# EAGLE design DSP_MOTU1_proto (EAGLE 7.3.0)

## Sheet 1 of 3: CON
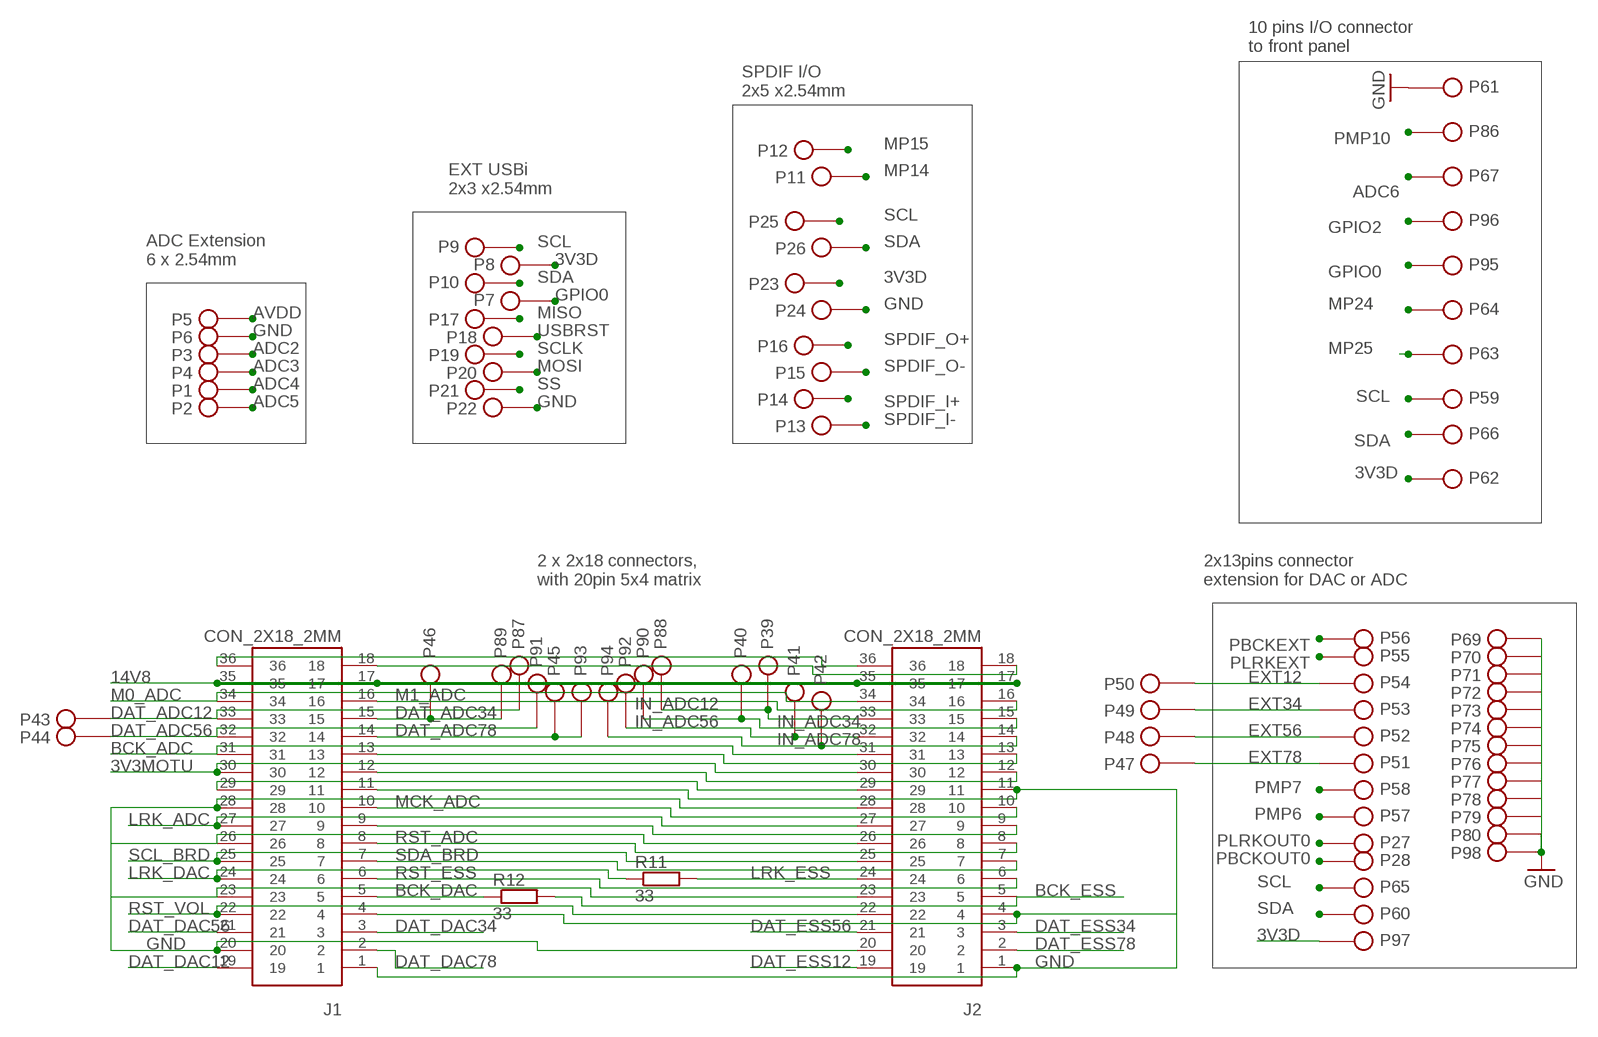
[diagram p0: schematic, sheet 1]

### Parts
J1  CON_2X18_2MM  [CON_2X18_2MM]
J2  CON_2X18_2MM  [CON_2X18_2MM]
P1  PIN_254  [PIN_254]
P2  PIN_254  [PIN_254]
P3  PIN_254  [PIN_254]
P4  PIN_254  [PIN_254]
P5  PIN_254  [PIN_254]
P6  PIN_254  [PIN_254]
P7  PIN_254  [PIN_254]
P8  PIN_254  [PIN_254]
P9  PIN_254  [PIN_254]
P10  PIN_254  [PIN_254]
P11  PIN_254  [PIN_254]
P12  PIN_254  [PIN_254]
P13  PIN_254  [PIN_254]
P14  PIN_254  [PIN_254]
P15  PIN_254  [PIN_254]
P16  PIN_254  [PIN_254]
P17  PIN_254  [PIN_254]
P18  PIN_254  [PIN_254]
P19  PIN_254  [PIN_254]
P20  PIN_254  [PIN_254]
P21  PIN_254  [PIN_254]
P22  PIN_254  [PIN_254]
P23  PIN_254  [PIN_254]
P24  PIN_254  [PIN_254]
P25  PIN_254  [PIN_254]
P26  PIN_254  [PIN_254]
P27  PIN_254  [PIN_254]
P28  PIN_254  [PIN_254]
P39  PIN_254  [PIN_254]
P40  PIN_254  [PIN_254]
P41  PIN_254  [PIN_254]
P42  PIN_254  [PIN_254]
P43  PIN_254  [PIN_254]
P44  PIN_254  [PIN_254]
P45  PIN_254  [PIN_254]
P46  PIN_254  [PIN_254]
P47  PIN_254  [PIN_254]
P48  PIN_254  [PIN_254]
P49  PIN_254  [PIN_254]
P50  PIN_254  [PIN_254]
P51  PIN_254  [PIN_254]
P52  PIN_254  [PIN_254]
P53  PIN_254  [PIN_254]
P54  PIN_254  [PIN_254]
P55  PIN_254  [PIN_254]
P56  PIN_254  [PIN_254]
P57  PIN_254  [PIN_254]
P58  PIN_254  [PIN_254]
P59  PIN_254  [PIN_254]
P60  PIN_254  [PIN_254]
P61  PIN_254  [PIN_254]
P62  PIN_254  [PIN_254]
P63  PIN_254  [PIN_254]
P64  PIN_254  [PIN_254]
P65  PIN_254  [PIN_254]
P66  PIN_254  [PIN_254]
P67  PIN_254  [PIN_254]
P69  PIN_254  [PIN_254]
P70  PIN_254  [PIN_254]
P71  PIN_254  [PIN_254]
P72  PIN_254  [PIN_254]
P73  PIN_254  [PIN_254]
P74  PIN_254  [PIN_254]
P75  PIN_254  [PIN_254]
P76  PIN_254  [PIN_254]
P77  PIN_254  [PIN_254]
P78  PIN_254  [PIN_254]
P79  PIN_254  [PIN_254]
P80  PIN_254  [PIN_254]
P86  PIN_254  [PIN_254]
P87  PIN_254  [PIN_254]
P88  PIN_254  [PIN_254]
P89  PIN_254  [PIN_254]
P90  PIN_254  [PIN_254]
P91  PIN_254  [PIN_254]
P92  PIN_254  [PIN_254]
P93  PIN_254  [PIN_254]
P94  PIN_254  [PIN_254]
P95  PIN_254  [PIN_254]
P96  PIN_254  [PIN_254]
P97  PIN_254  [PIN_254]
P98  PIN_254  [PIN_254]
R11  33  R-EU_R0805  [R0805]
R12  33  R-EU_R0805  [R0805]

### Nets
3V3D: P8.1 P23.1 P62.1 P97.1 ; also sheet 2,3
3V3MOTU: J1.30 J2.30
14V8: J1.17 J1.35 J2.17 J2.35 ; also sheet 3
ADC2: P3.1 ; also sheet 2
ADC3: P4.1 ; also sheet 2
ADC4: P1.1 ; also sheet 2
ADC5: P2.1 ; also sheet 2
ADC6: P67.1 ; also sheet 2
AVDD: P5.1 ; also sheet 2
BCK_ADC: J1.31 J2.31 ; also sheet 2
BCK_DAC: J1.5 R12.1 ; also sheet 2
BCK_ESS: J2.5 R12.2 ; also sheet 2
DAT_ADC12: J1.33 P43.1 P87.1
DAT_ADC34: J1.15 P46.1 P89.1
DAT_ADC56: J1.32 P44.1 P91.1
DAT_ADC78: J1.14 P45.1 P93.1
DAT_DAC12: J1.19 ; also sheet 2
DAT_DAC34: J1.3 ; also sheet 2
DAT_DAC56: J1.21 ; also sheet 2
DAT_DAC78: J1.2 ; also sheet 2
DAT_ESS12: J2.19 ; also sheet 2
DAT_ESS34: J2.3 ; also sheet 2
DAT_ESS56: J2.21 ; also sheet 2
DAT_ESS78: J2.2 ; also sheet 2
EXT12: P50.1 P54.1
EXT34: P49.1 P53.1
EXT56: P48.1 P52.1
EXT78: P47.1 P51.1
GND: J1.1 J1.4 J1.11 J1.20 J1.23 J1.26 J1.28 J2.1 J2.4 J2.11 J2.20 J2.23 J2.26 J2.28 P6.1 P22.1 P24.1 P61.1 P69.1 P70.1 P71.1 P72.1 P73.1 P74.1 P75.1 P76.1 P77.1 P78.1 P79.1 P80.1 P98.1 ; also sheet 2,3
GPIO0: P7.1 P95.1 ; also sheet 3
GPIO2: P96.1 ; also sheet 3
IN_ADC12: J2.33 P39.1 P88.1
IN_ADC34: J2.15 P40.1 P90.1
IN_ADC56: J2.32 P41.1 P92.1
IN_ADC78: J2.14 P42.1 P94.1
LRK_ADC: J1.27 J2.27 ; also sheet 2
LRK_DAC: J1.24 R11.1 ; also sheet 2
LRK_ESS: J2.24 R11.2 ; also sheet 2
M0_ADC: J1.34 J2.34
M1_ADC: J1.16 J2.16
MCK_ADC: J1.10 J2.10
MISO: P17.1 ; also sheet 2,3
MOSI: P20.1 ; also sheet 2,3
MP14: P11.1 ; also sheet 2
MP15: P12.1 ; also sheet 2
MP24: P64.1 ; also sheet 2
MP25: P63.1 ; also sheet 2
N$51: J1.9 J2.9
N$54: J1.29 J2.29
N$55: J1.12 J2.12
N$56: J1.13 J2.13
N$57: J1.18 J2.18
N$58: J1.36 J2.36
PBCKEXT: P56.1 ; also sheet 2
PBCKOUT0: P28.1 ; also sheet 2
PLRKEXT: P55.1 ; also sheet 2
PLRKOUT0: P27.1 ; also sheet 2
PMP6: P57.1 ; also sheet 2
PMP7: P58.1 ; also sheet 2
PMP10: P86.1 ; also sheet 2,3
RST_ADC: J1.8 J2.8
RST_ESS: J1.6 J2.6
RST_VOL: J1.22 J2.22 ; also sheet 2
SCL: P9.1 P25.1 P59.1 P65.1 ; also sheet 3
SCL_BRD: J1.25 J2.25
SCLK: P19.1 ; also sheet 2,3
SDA: P10.1 P26.1 P60.1 P66.1 ; also sheet 3
SDA_BRD: J1.7 J2.7
SPDIF_I+: P14.1 ; also sheet 2
SPDIF_I-: P13.1 ; also sheet 2
SPDIF_O+: P16.1 ; also sheet 2
SPDIF_O-: P15.1 ; also sheet 2
SS: P21.1 ; also sheet 2,3
USBRST: P18.1 ; also sheet 2

### Notes on the sheet
- 10 pins I/O connector
  to front panel
- SPDIF I/O
  2x5 x2.54mm
- EXT USBi
  2x3 x2.54mm
- ADC Extension
  6 x 2.54mm
- 2 x 2x18 connectors, 
  with 20pin 5x4 matrix
- 2x13pins connector
  extension for DAC or ADC

## Sheet 2 of 3: DSP
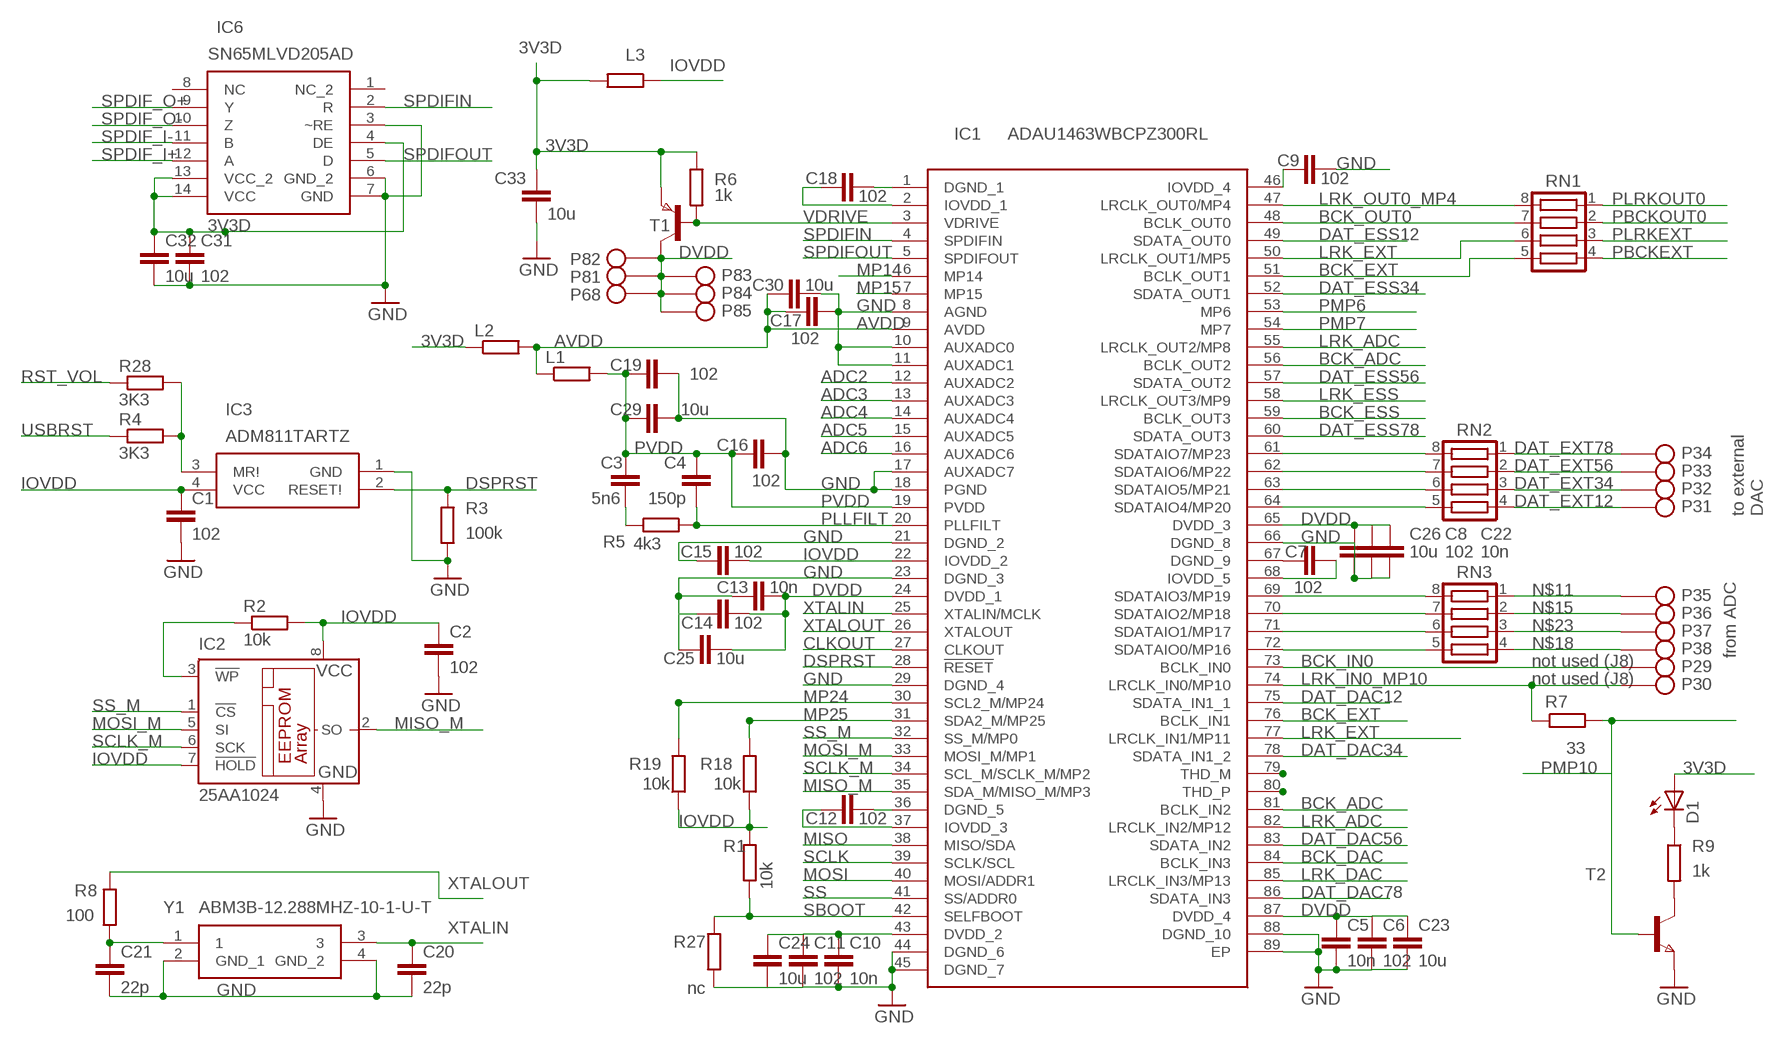
[diagram p1: schematic, sheet 2]

### Parts
C1  102  C-EUC0603  [C0603]
C2  102  C-EUC0603  [C0603]
C3  5n6  C-EUC0402  [C0402]
C4  150p  C-EUC0402  [C0402]
C5  10n  C-EUC0402  [C0402]
C6  102  C-EUC0402  [C0402]
C7  102  C-EUC0402  [C0402]
C8  102  C-EUC0402  [C0402]
C9  102  C-EUC0402  [C0402]
C10  10n  C-EUC0402  [C0402]
C11  102  C-EUC0402  [C0402]
C12  102  C-EUC0402  [C0402]
C13  10n  C-EUC0402  [C0402]
C14  102  C-EUC0402  [C0402]
C15  102  C-EUC0402  [C0402]
C16  102  C-EUC0402  [C0402]
C17  102  C-EUC0402  [C0402]
C18  102  C-EUC0402  [C0402]
C19  102  C-EUC0603  [C0603]
C20  22p  C-EUC0402  [C0402]
C21  22p  C-EUC0402  [C0402]
C22  10n  C-EUC0402  [C0402]
C23  10u  C-EUC0805  [C0805]
C24  10u  C-EUC0805  [C0805]
C25  10u  C-EUC0805  [C0805]
C26  10u  C-EUC0805  [C0805]
C29  10u  C-EUC0805  [C0805]
C30  10u  C-EUC0805  [C0805]
C31  102  C-EUC0603  [C0603]
C32  10u  C-EUC0805  [C0805]
C33  10u  C-EUC0805  [C0805]
D1  LEDCHIPLED_0805  [CHIPLED_0805]
IC1  ADAU1463WBCPZ300RL  [ADAU1463WBCPZ300RL]
IC2  25AA1024  25AA080SN  [SO-08]
IC3  ADM811TARTZ  ADM811RARTZ-REEL7  [SOT192P237X117-4N]
IC6  SN65MLVD205AD  [SOIC127P600X175-14N]
L1  R-EU_R0603  [R0603]
L2  R-EU_R0603  [R0603]
L3  R-EU_R0805  [R0805]
P29  PIN_254  [PIN_254]
P30  PIN_254  [PIN_254]
P31  PIN_254  [PIN_254]
P32  PIN_254  [PIN_254]
P33  PIN_254  [PIN_254]
P34  PIN_254  [PIN_254]
P35  PIN_254  [PIN_254]
P36  PIN_254  [PIN_254]
P37  PIN_254  [PIN_254]
P38  PIN_254  [PIN_254]
P68  PIN_254  [PIN_254]
P81  PIN_254  [PIN_254]
P82  PIN_254  [PIN_254]
P83  PIN_254  [PIN_254]
P84  PIN_254  [PIN_254]
P85  PIN_254  [PIN_254]
R1  10k  R-EU_R0603  [R0603]
R2  10k  R-EU_R0603  [R0603]
R3  100k  R-EU_R0603  [R0603]
R4  3K3  R-EU_R0603  [R0603]
R5  4k3  R-EU_R0402  [R0402]
R6  1k  R-EU_R0603  [R0603]
R7  33  R-EU_R0805  [R0805]
R8  100  R-EU_R0402  [R0402]
R9  1k  R-EU_R0603  [R0603]
R18  10k  R-EU_R0603  [R0603]
R19  10k  R-EU_R0603  [R0603]
R27  nc  R-EU_R0603  [R0603]
R28  3K3  R-EU_R0603  [R0603]
RN1  CTS742C083  [CTS742C083]
RN2  CTS742C083  [CTS742C083]
RN3  CTS742C083  [CTS742C083]
T1  PNPSOT89  [SOT89]
T2  NPNSOT23  [SOT-23]
Y1  ABM3B-12.288MHZ-10-1-U-T  [ABM3B]

### Nets
3V3D: C31.1 C32.1 C33.1 D1.A IC6.4(DE) IC6.13(VCC_2) IC6.14(VCC) L2.1 L3.2 R6.1 T1.3(E) ; also sheet 1,3
ADC2: IC1.12(AUXADC2) ; also sheet 1
ADC3: IC1.13(AUXADC3) ; also sheet 1
ADC4: IC1.14(AUXADC4) ; also sheet 1
ADC5: IC1.15(AUXADC5) ; also sheet 1
ADC6: IC1.16(AUXADC6) ; also sheet 1
AVDD: C17.1 C30.1 IC1.9(AVDD) L1.1 L2.2 ; also sheet 1
BCK_ADC: IC1.56(BCLK_OUT2) IC1.81(BCLK_IN2) ; also sheet 1
BCK_DAC: IC1.84(BCLK_IN3) ; also sheet 1
BCK_ESS: IC1.59(BCLK_OUT3) ; also sheet 1
BCK_EXT: IC1.51(BCLK_OUT1) IC1.76(BCLK_IN1) RN1.5
BCK_IN0: IC1.73(BCLK_IN0) P29.1
BCK_OUT0: IC1.48(BCLK_OUT0) RN1.7
CLKOUT: IC1.27(CLKOUT)
DAT_DAC12: IC1.75(SDATA_IN1_1) ; also sheet 1
DAT_DAC34: IC1.78(SDATA_IN1_2) ; also sheet 1
DAT_DAC56: IC1.83(SDATA_IN2) ; also sheet 1
DAT_DAC78: IC1.86(SDATA_IN3) ; also sheet 1
DAT_ESS12: IC1.49(SDATA_OUT0) ; also sheet 1
DAT_ESS34: IC1.52(SDATA_OUT1) ; also sheet 1
DAT_ESS56: IC1.57(SDATA_OUT2) ; also sheet 1
DAT_ESS78: IC1.60(SDATA_OUT3) ; also sheet 1
DAT_EXT12: P31.1 RN2.4
DAT_EXT34: P32.1 RN2.3
DAT_EXT56: P33.1 RN2.2
DAT_EXT78: P34.1 RN2.1
DAT_IO12: IC1.72(SDATAIO0/MP16) RN3.5
DSPRST: IC1.28(!RESET) IC3.2(RESET!) R3.1 ; also sheet 3
DVDD: C5.1 C6.1 C8.1 C10.1 C11.1 C13.1 C14.1 C22.1 C23.1 C24.1 C25.1 C26.2 IC1.24(DVDD_1) IC1.43(DVDD_2) IC1.65(DVDD_3) IC1.87(DVDD_4) P68.1 P81.1 P82.1 P83.1 P84.1 P85.1 T1.2(C) T1.2@1(C)
GND: C1.2 C2.2 C5.2 C6.2 C7.2 C8.2 C9.2 C10.2 C11.2 C12.2 C13.2 C14.2 C15.2 C16.2 C17.2 C18.2 C19.2 C20.2 C21.2 C22.2 C23.2 C24.2 C25.2 C26.1 C29.2 C30.2 C31.2 C32.2 C33.2 IC1.1(DGND_1) IC1.8(AGND) IC1.10(AUXADC0) IC1.11(AUXADC1) IC1.17(AUXADC7) IC1.18(PGND) IC1.21(DGND_2) IC1.23(DGND_3) IC1.29(DGND_4) IC1.36(DGND_5) IC1.44(DGND_6) IC1.45(DGND_7) IC1.66(DGND_8) IC1.67(DGND_9) IC1.88(DGND_10) IC1.89(EP) IC2.4(GND) IC3.1(GND) IC6.3(~RE) IC6.6(GND_2) IC6.7(GND) R3.2 R27.1 T2.2(E) Y1.2(GND_1) Y1.4(GND_2) ; also sheet 1,3
IOVDD: C1.1 C2.1 C7.1 C9.1 C12.1 C15.1 C18.1 IC1.2(IOVDD_1) IC1.22(IOVDD_2) IC1.37(IOVDD_3) IC1.46(IOVDD_4) IC1.68(IOVDD_5) IC2.7(!HOLD) IC2.8(VCC) IC3.4(VCC) L3.1 R1.2 R2.2 R18.1 R19.1
LRK_ADC: IC1.55(LRCLK_OUT2/MP8) IC1.82(LRCLK_IN2/MP12) ; also sheet 1
LRK_DAC: IC1.85(LRCLK_IN3/MP13) ; also sheet 1
LRK_ESS: IC1.58(LRCLK_OUT3/MP9) ; also sheet 1
LRK_EXT: IC1.50(LRCLK_OUT1/MP5) IC1.77(LRCLK_IN1/MP11) RN1.6
LRK_IN0_MP10: IC1.74(LRCLK_IN0/MP10) P30.1 R7.1
LRK_OUT0_MP4: IC1.47(LRCLK_OUT0/MP4) RN1.8
MISO: IC1.38(MISO/SDA) ; also sheet 1,3
MISO_M: IC1.35(SDA_M/MISO_M/MP3) IC2.2(SO)
MOSI: IC1.40(MOSI/ADDR1) ; also sheet 1,3
MOSI_M: IC1.33(MOSI_M/MP1) IC2.5(SI)
MP14: IC1.6(MP14) ; also sheet 1
MP15: IC1.7(MP15) ; also sheet 1
MP24: IC1.30(SCL2_M/MP24) R19.2 ; also sheet 1
MP25: IC1.31(SDA2_M/MP25) R18.2 ; also sheet 1
N$1: R9.2 T2.1(C)
N$2: IC1.64(SDATAIO4/MP20) RN2.5
N$3: IC1.63(SDATAIO5/MP21) RN2.6
N$4: IC2.3(!WP) R2.1
N$5: IC1.62(SDATAIO6/MP22) RN2.7
N$6: IC1.61(SDATAIO7/MP23) RN2.8
N$7: IC1.70(SDATAIO2/MP18) RN3.7
N$8: IC1.71(SDATAIO1/MP17) RN3.6
N$9: IC1.79(THD_M)
N$10: C21.1 R8.1 Y1.1
N$11: P35.1 RN3.1
N$12: C3.2 R5.2
N$13: IC1.69(SDATAIO3/MP19) RN3.8
N$14: D1.C R9.1
N$15: P36.1 RN3.2
N$17: IC1.80(THD_P)
N$18: P38.1 RN3.4
N$23: P37.1 RN3.3
PBCKEXT: RN1.4 ; also sheet 1
PBCKOUT0: RN1.2 ; also sheet 1
PLLFILT: C4.2 IC1.20(PLLFILT) R5.1
PLRKEXT: RN1.3 ; also sheet 1
PLRKOUT0: RN1.1 ; also sheet 1
PMP6: IC1.53(MP6) ; also sheet 1
PMP7: IC1.54(MP7) ; also sheet 1
PMP10: R7.2 T2.3(B) ; also sheet 1,3
PVDD: C3.1 C4.1 C16.1 C19.1 C29.1 IC1.19(PVDD) L1.2
RST_VOL: R28.1 ; also sheet 1
SBOOT: IC1.42(SELFBOOT) R1.1 R27.2
SCLK: IC1.39(SCLK/SCL) ; also sheet 1,3
SCLK_M: IC1.34(SCL_M/SCLK_M/MP2) IC2.6(SCK)
SPDIF_I+: IC6.12(A) ; also sheet 1
SPDIF_I-: IC6.11(B) ; also sheet 1
SPDIF_O+: IC6.9(Y) ; also sheet 1
SPDIF_O-: IC6.10(Z) ; also sheet 1
SPDIFIN: IC1.4(SPDIFIN) IC6.2(R)
SPDIFOUT: IC1.5(SPDIFOUT) IC6.5(D)
SS: IC1.41(SS/ADDR0) ; also sheet 1,3
SS_M: IC1.32(SS_M/MP0) IC2.1(!CS)
USBRST: R4.1 ; also sheet 1
USBRST_: IC3.3(MR!) R4.2 R28.2
VDRIVE: IC1.3(VDRIVE) R6.2 T1.1(B)
XTALIN: C20.1 IC1.25(XTALIN/MCLK) Y1.3
XTALOUT: IC1.26(XTALOUT) R8.2
Unconnected: IC6.1(NC_2) IC6.8(NC)

### Notes on the sheet
- to external
  DAC
- from ADC
- not used (J8)
- not used (J8)

## Sheet 3 of 3: IO-ESP
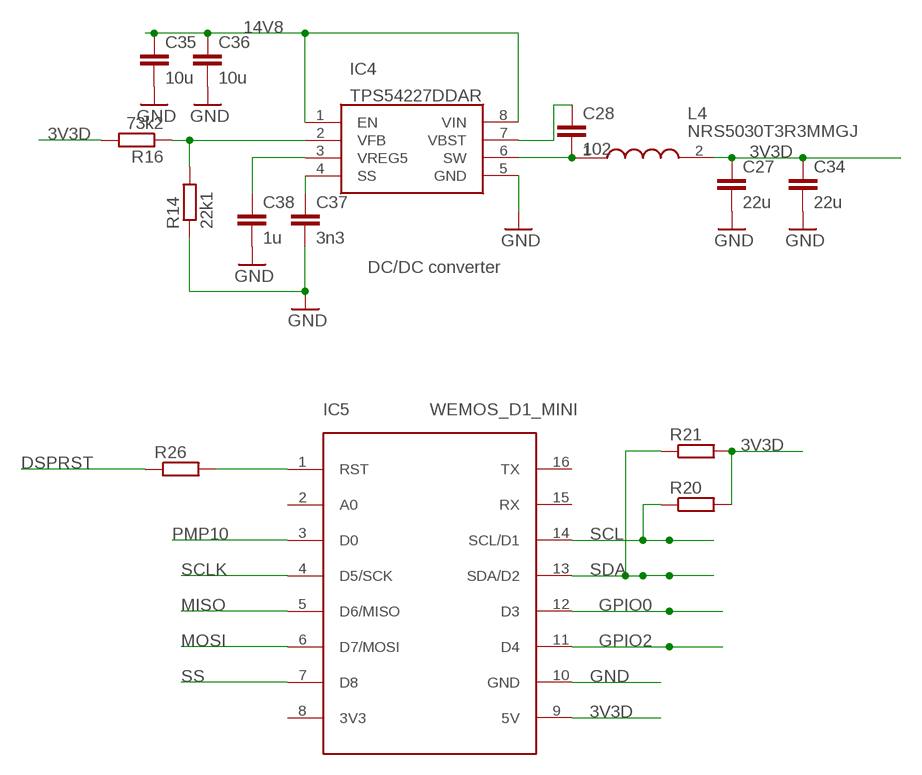
[diagram p2: schematic, sheet 3]

### Parts
C27  22u  C-EUC1206  [C1206]
C28  102  C-EUC0603  [C0603]
C34  22u  C-EUC1206  [C1206]
C35  10u  C-EUC1210  [C1210]
C36  10u  C-EUC1210  [C1210]
C37  3n3  C-EUC0603  [C0603]
C38  1u  C-EUC0603K  [C0603K]
IC4  TPS54227DDAR  [SOIC127P600X170-8N]
IC5  WEMOS_D1_MINI  [WEMOS_D1_MINI]
L4  NRS5030T3R3MMGJ  [INDC4949X330N]
R14  22k1  R-EU_R0603  [R0603]
R16  73k2  R-EU_R0603  [R0603]
R20  R-EU_R0603  [R0603]
R21  R-EU_R0603  [R0603]
R26  R-EU_R0603  [R0603]

### Nets
3V3D: C27.1 C34.1 IC5.9(5V) L4.2 R16.2 R20.2 R21.2 ; also sheet 1,2
14V8: C35.1 C36.1 IC4.1(EN) IC4.8(VIN) ; also sheet 1
D1_RST: IC5.1(RST) R26.2
DSPRST: R26.1 ; also sheet 2
GND: C27.2 C34.2 C35.2 C36.2 C37.2 C38.2 IC4.5(GND) IC5.10(GND) R14.1 ; also sheet 1,2
GPIO0: IC5.12(D3) ; also sheet 1
GPIO2: IC5.11(D4) ; also sheet 1
MISO: IC5.5(D6/MISO) ; also sheet 1,2
MOSI: IC5.6(D7/MOSI) ; also sheet 1,2
N$19: C28.2 IC4.6(SW) L4.1
N$20: C28.1 IC4.7(VBST)
N$22: C37.1 IC4.4(SS)
N$32: C38.1 IC4.3(VREG5)
N$33: IC4.2(VFB) R14.2 R16.1
PMP10: IC5.3(D0) ; also sheet 1,2
SCL: IC5.14(SCL/D1) R20.1 ; also sheet 1
SCLK: IC5.4(D5/SCK) ; also sheet 1,2
SDA: IC5.13(SDA/D2) R21.1 ; also sheet 1
SS: IC5.7(D8) ; also sheet 1,2
Unconnected: IC5.2(A0) IC5.8(3V3) IC5.15(RX) IC5.16(TX)

### Notes on the sheet
- DC/DC converter

## Library data of the parts
C1-C38 = rcl:C-EU: CAPACITOR, European symbol
D1 = led:LED: LED OSRAM: - CHIPLED LG R971, LG N971, LY N971, LG Q971, LY Q971, LO R971, LY R971 LH N974, LH R974 LS Q976, LO Q976, LY Q976 LO Q996 - Hyper CHIPLED LW Q18S LB Q993, LB Q99A, LB R99A - SideLED LS A670, LO A670, LY A670, LG A670, LP A670 LB A673, LV A673, LT A673, LW A673 LH A674 LY A675 LS A676, LA A676, LO A676, LY A676, LW A676 LS A679, LY A679, LG A679 - Hyper Micro SIDELED® LS Y876, LA Y876, LO Y876, LY Y876 LT Y87S - SmartLED LW L88C, LW L88S LB L89C, LB L89S, LG L890 LS L89K, LO L89K, LY L89K LS L896, LA L896, LO L896, LY L896 - TOPLED LS T670, LO T670, LY T670, LG T670, LP T670 LSG T670, LSP T670, LSY T670, LOP T670, LYG T670 LG T671, LOG T671, LSG T671 LB T673, LV T673, LT T673, LW T673 LH T674 LS T676, LA T676, LO T676, LY T676, LB T676, LH T676, LSB T676, LW T676 LB T67C, LV T67C, LT T67C, LS T67K, LO T67K, LY T67K, LW E67C LS E67B, LA E67B, LO E67B, LY E67B, LB E67C, LV E67C, LT E67C LW T67C LS T679, LY T679, LG T679 LS T770, LO T770, LY T770, LG T770, LP T770 LB T773, LV T773, LT T773, LW T773 LH T774 LS E675, LA E675, LY E675, LS T675 LS T776, LA T776, LO T776, LY T776, LB T776 LHGB T686 LT T68C, LB T68C - Hyper Mini TOPLED® LB M676 - Mini TOPLED Santana® LG M470 LS M47K, LO M47K, LY M47K Source: http://www.osram.convergy.de LUXEON: - LUMILED® LXK2-PW12-R00, LXK2-PW12-S00, LXK2-PW14-U00, LXK2-PW14-V00 LXK2-PM12-R00, LXK2-PM12-S00, LXK2-PM14-U00 LXK2-PE12-Q00, LXK2-PE12-R00, LXK2-PE12-S00, LXK2-PE14-T00, LXK2-PE14-U00 LXK2-PB12-K00, LXK2-PB12-L00, LXK2-PB12-M00, LXK2-PB14-N00, LXK2-PB14-P00, LXK2-PB14-Q00 LXK2-PR12-L00, LXK2-PR12-M00, LXK2-PR14-Q00, LXK2-PR14-R00 LXK2-PD12-Q00, LXK2-PD12-R00, LXK2-PD12-S00 LXK2-PH12-R00, LXK2-PH12-S00 LXK2-PL12-P00, LXK2-PL12-Q00, LXK2-PL12-R00 Source: www.luxeon.com KINGBRIGHT: KA-3528ASYC Source: www.kingbright.com
IC1 = SamacSys_Parts:ADAU1463WBCPZ300RL: Audio DSPs 32bit SigmaDSP Audio 16K/48K Source: Datasheet <https://mentor.componentsearchengine.com/Datasheets/1/ADAU1463WBCPZ300RL.pdf>; DESCRIPTION: Audio DSPs 32bit SigmaDSP Audio 16K/48K; HEIGHT: 0mm; MANUFACTURER_NAME: Analog Devices; MANUFACTURER_PART_NUMBER: ADAU1463WBCPZ300RL; MOUSER_PART_NUMBER: 584-AU1463WBCPZ300RL; MOUSER_PRICE-STOCK: https://www.mouser.com/Search/Refine.aspx?Keyword=584-AU1463WBCPZ300RL
IC2 = microchip:25*: Serial EEPROM 4K/ 8K , SPI bus; MF: MICROCHIP; MPN: 25AA080/SN; OC_FARNELL: 1816072; OC_NEWARK: 92C7351
IC3 = SamacSys_Parts:ADM811RARTZ-REEL7: Analog Devices ADM811RARTZ-REEL7, Processor Supervisor 2.5 5 V, Reset Input, 4-Pin SOT-143 Source: Datasheet <https://componentsearchengine.com/Datasheets/1/ADM811RARTZ-REEL7.pdf>; DESCRIPTION: Analog Devices ADM811RARTZ-REEL7, Processor Supervisor 2.5 5 V, Reset Input, 4-Pin SOT-143; HEIGHT: mm; MANUFACTURER_NAME: Analog Devices; MANUFACTURER_PART_NUMBER: ADM811RARTZ-REEL7; MOUSER_PART_NUMBER: 584-ADM811RARTZ-R7
IC4 = SamacSys_Parts:TPS54227DDAR: 4.5V to 18V Input, 2A Synchronous Step-Down Converter Source: Datasheet <http://www.ti.com/lit/gpn/tps54227>; DESCRIPTION: 4.5V to 18V Input, 2A Synchronous Step-Down Converter; HEIGHT: 1.7mm; MANUFACTURER_NAME: Texas Instruments; MANUFACTURER_PART_NUMBER: TPS54227DDAR; MOUSER_PART_NUMBER: 595-TPS54227DDAR
IC5 = perso:WEMOS_D1_MINI
IC6 = SamacSys_Parts:SN65MLVD205AD: MULTIPOINT-LVDS LINE DRIVER AND RECEIVER Source: Datasheet <http://www.ti.com/lit/gpn/sn65mlvd205a>; DESCRIPTION: MULTIPOINT-LVDS LINE DRIVER AND RECEIVER; HEIGHT: mm; MANUFACTURER_NAME: Texas Instruments; MANUFACTURER_PART_NUMBER: SN65MLVD205AD; MOUSER_PART_NUMBER: 595-SN65MLVD205AD
J1 J2 = perso:CON_2X18_2MM
L1-L3 R1-R9 R11 R12 R14 R16 R18-R21 R26-R28 = rcl:R-EU_: RESISTOR, European symbol
L4 = SamacSys_Parts:NRS5030T3R3MMGJ: Fixed Inductors INDCTR LW PROFL WND 3.3uH +/- 20% TOL Source: Datasheet <https://componentsearchengine.com/Datasheets/1/NRS5030T3R3MMGJ.pdf>; DESCRIPTION: Fixed Inductors INDCTR LW PROFL WND 3.3uH +/- 20% TOL; HEIGHT: 3.3mm; MANUFACTURER_NAME: TAIYO YUDEN; MANUFACTURER_PART_NUMBER: NRS5030T3R3MMGJ; MOUSER_PART_NUMBER: 963-NRS5030T3R3MMGJ
P1-P98 = perso:PIN_254
RN1-RN3 = resistor-net:CTS742C083: Chip Resistor Array 4 Single Resistor Source: http://www.ctscorp.com/components/Datasheets/CTSChipArrayDs.pdf; OC_FARNELL: unknown; OC_NEWARK: unknown
T1 = zetex:PNPSOT89: PNP TRANSISTOR; MPN: 2DB1713-13; OC_FARNELL: 1710687; OC_NEWARK: 25R5670
T2 = zetex:NPNSOT23: NPN TRANSISTOR; MPN: DSS20201L-7; OC_FARNELL: 1710688; OC_NEWARK: 25R4555
Y1 = SamacSys_Parts:ABM3B-12.288MHZ-10-1-U-T: ABRACON - ABM3B-12.288MHZ-10-1-U-T - CRYSTAL, 12.288MHZ, 10PF, 5 X 3.2MM Source: Datasheet <https://componentsearchengine.com/Datasheets/1/ABM3B-12.288MHZ-10-1-U-T.pdf>; DESCRIPTION: ABRACON - ABM3B-12.288MHZ-10-1-U-T - CRYSTAL, 12.288MHZ, 10PF, 5 X 3.2MM; HEIGHT: mm; MANUFACTURER_NAME: ABRACON; MANUFACTURER_PART_NUMBER: ABM3B-12.288MHZ-10-1-U-T; MOUSER_PART_NUMBER: 815-ABM3B-12.288-T

## Board
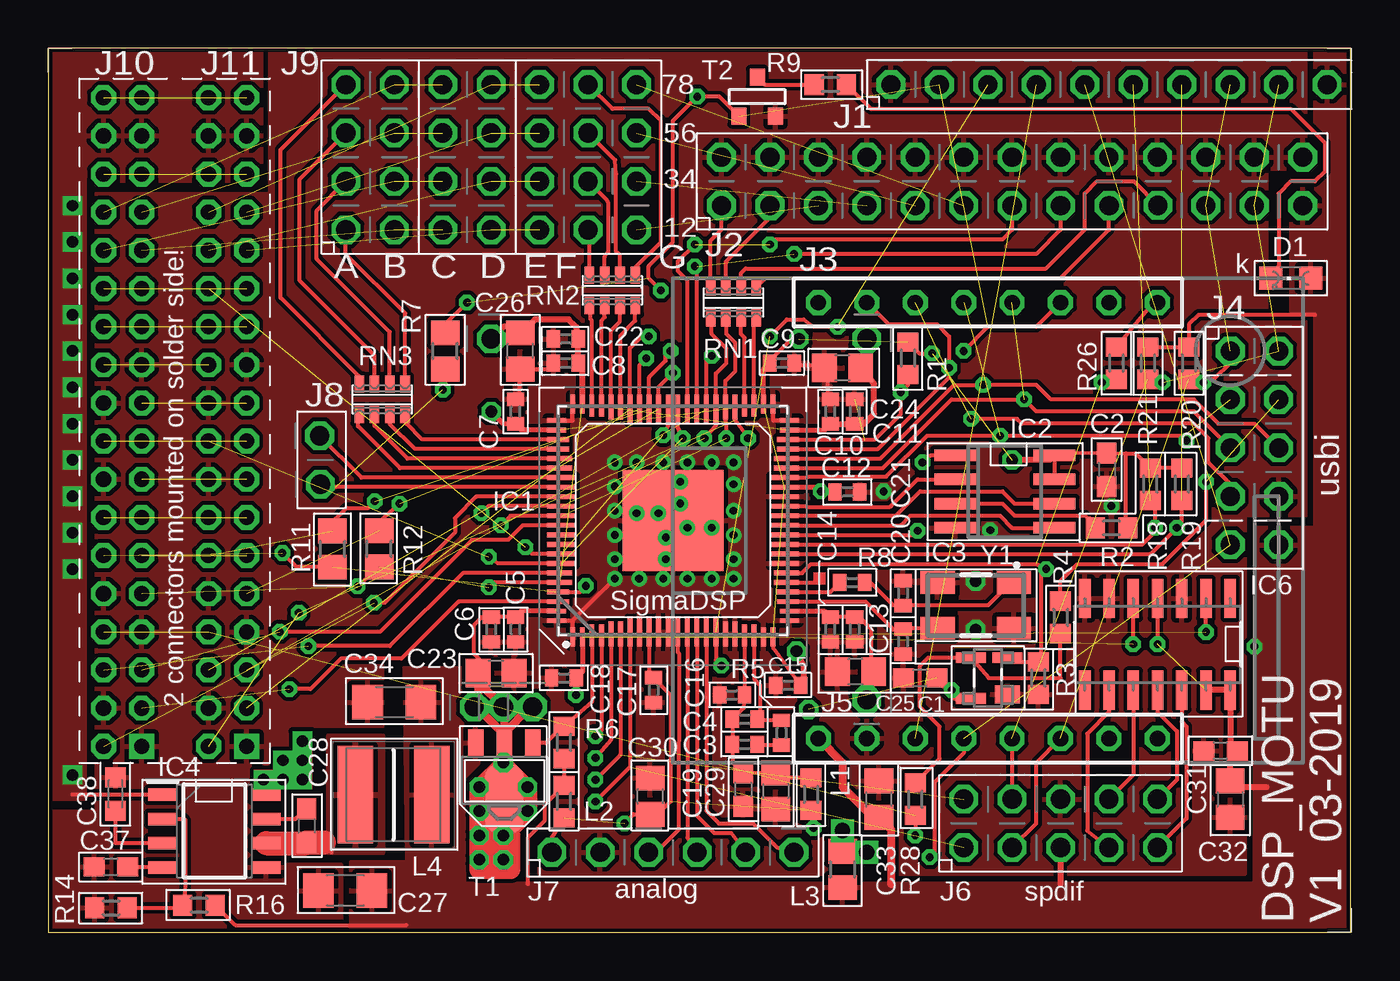
[diagram p3: board, top side]
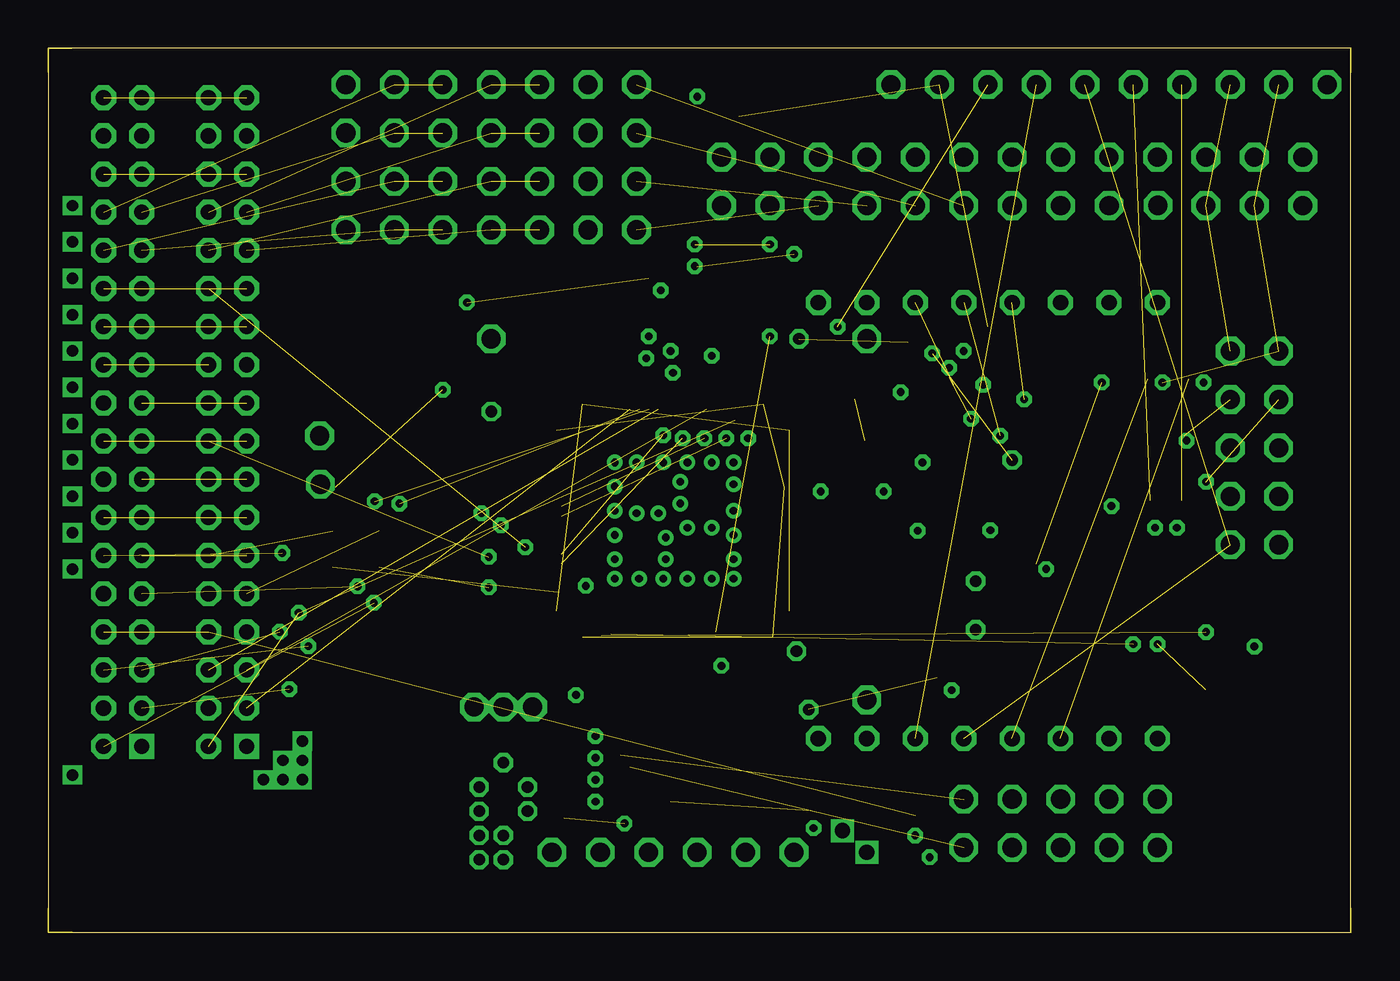
[diagram p4: board, inner layer Route2]
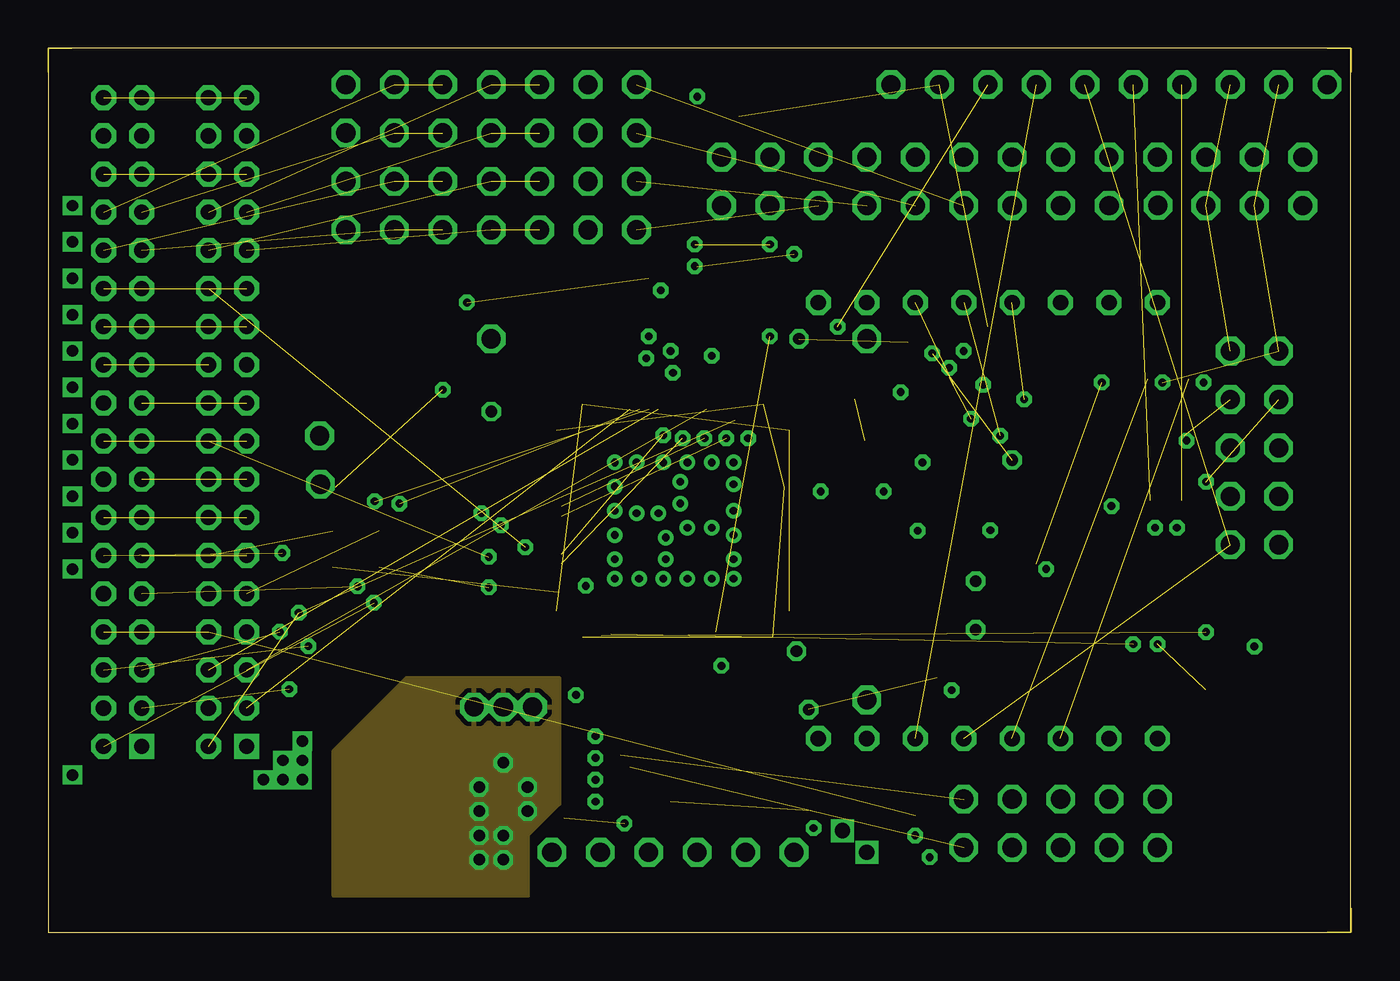
[diagram p5: board, inner layer Route15]
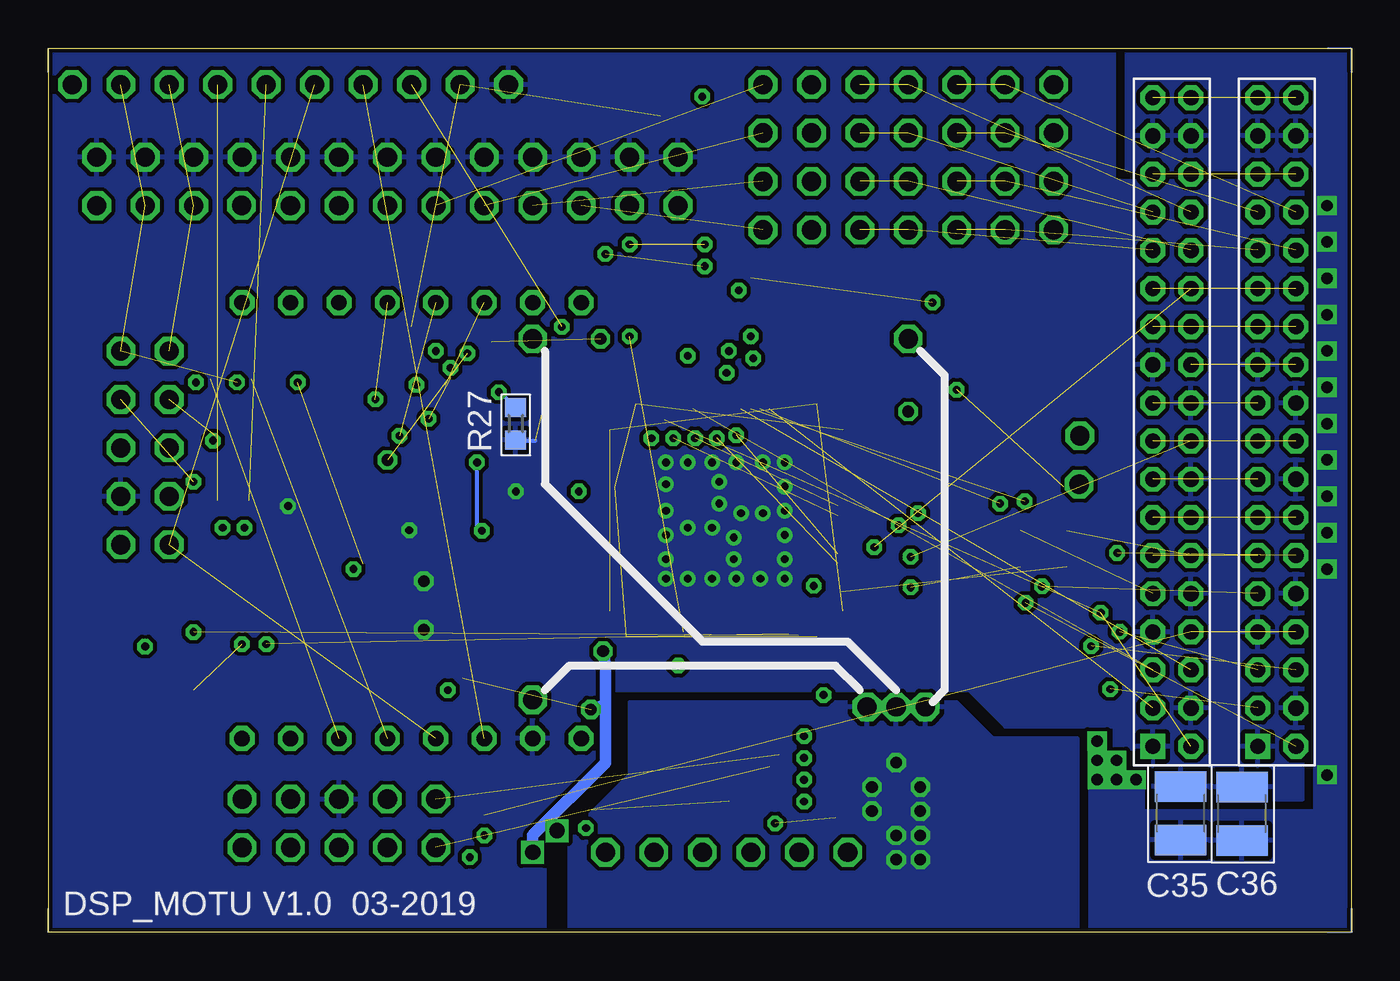
[diagram p6: board, bottom side, seen from below]

Size 68.29 x 46.36 mm. Coordinates in mm from the lower left corner, seen from the top.
Outline: 0,0 68.29,0 68.29,46.36 0,46.36 0,0
Copper layers (1*2*15*16): Top 0.035mm / dielectric 1.5mm / Route2 0.035mm / dielectric 0.15mm / Route15 0.035mm / dielectric 0.2mm / Bottom 0.035mm
Design rules "default *": minimum track width 8mil, minimum drill 16mil, track to track 8mil, track to pad 8mil, pad to pad 8mil, via to via 8mil, smd to smd 8mil, copper to edge 8mil, drill to drill 10mil, minimum pad ring 10mil, minimum via ring 8mil, stop-mask expansion 4mil, vias tented up to drill 0mil, thermal gap 10mil

### Footprints (pad centres in the part's own frame; a part is rotated, then mirrored left to right if it is on the bottom)
C0603 = smd 1.1 x 1: 1 -0.875,0; 2 0.875,0
C0402 = smd 0.7 x 0.9: 1 -0.65,0; 2 0.65,0
C0805 = smd 1.3 x 1.5: 1 -0.95,0; 2 0.95,0
C1206 = smd 1.6 x 1.8: 1 -1.4,0; 2 1.4,0
C1210 = smd 1.6 x 2.7: 1 -1.4,0; 2 1.4,0
C0603K = smd 1.05 x 1.08: 1 -0.875,0; 2 0.875,0
CHIPLED_0805 = smd 1.2 x 1.2: A 0,-1.05; C 0,1.05
ADAU1463WBCPZ300RL = smd 1 x 0.25: 1 -6.1,5.25; 2 -6.1,4.75; 21 -6.1,-4.75; 22 -6.1,-5.25; 45 6.1,-5.25; 46 6.1,-4.75; 65 6.1,4.75; 66 6.1,5.25 | smd 1.15 x 0.25: 3 -6.025,4.25; 4 -6.025,3.75; 19 -6.025,-3.75; 20 -6.025,-4.25; 47 6.025,-4.25; 48 6.025,-3.75; 63 6.025,3.75; 64 6.025,4.25 | smd 1.3 x 0.25: 5 -5.95,3.25; 6 -5.95,2.75; 17 -5.95,-2.75; 18 -5.95,-3.25; 49 5.95,-3.25; 50 5.95,-2.75; 61 5.95,2.75; 62 5.95,3.25 | smd 1.5 x 0.25: 7 -5.85,2.25; 8 -5.85,1.75; 9 -5.85,1.25; 10 -5.85,0.75; 11 -5.85,0.25; 12 -5.85,-0.25; 13 -5.85,-0.75; 14 -5.85,-1.25; 15 -5.85,-1.75; 16 -5.85,-2.25; 51 5.85,-2.25; 52 5.85,-1.75; 53 5.85,-1.25; 54 5.85,-0.75; 55 5.85,-0.25; 56 5.85,0.25; 57 5.85,0.75; 58 5.85,1.25; 59 5.85,1.75; 60 5.85,2.25 | smd 0.25 x 1: 23 -5.25,-6.1; 24 -4.75,-6.1; 43 4.75,-6.1; 44 5.25,-6.1; 67 5.25,6.1; 68 4.75,6.1; 87 -4.75,6.1; 88 -5.25,6.1 | smd 0.25 x 1.15: 25 -4.25,-6.025; 26 -3.75,-6.025; 41 3.75,-6.025; 42 4.25,-6.025; 69 4.25,6.025; 70 3.75,6.025; 85 -3.75,6.025; 86 -4.25,6.025 | smd 0.25 x 1.3: 27 -3.25,-5.95; 28 -2.75,-5.95; 39 2.75,-5.95; 40 3.25,-5.95; 71 3.25,5.95; 72 2.75,5.95; 83 -2.75,5.95; 84 -3.25,5.95 | smd 0.25 x 1.5: 29 -2.25,-5.85; 30 -1.75,-5.85; 31 -1.25,-5.85; 32 -0.75,-5.85; 33 -0.25,-5.85; 34 0.25,-5.85; 35 0.75,-5.85; 36 1.25,-5.85; 37 1.75,-5.85; 38 2.25,-5.85; 73 2.25,5.85; 74 1.75,5.85; 75 1.25,5.85; 76 0.75,5.85; 77 0.25,5.85; 78 -0.25,5.85; 79 -0.75,5.85; 80 -1.25,5.85; 81 -1.75,5.85; 82 -2.25,5.85 | smd 5.3 x 5.3: 89 0,0
SO-08 = smd 0.6 x 2.2: 1 -1.905,-2.6; 2 -0.635,-2.6; 3 0.635,-2.6; 4 1.905,-2.6; 5 1.905,2.6; 6 0.635,2.6; 7 -0.635,2.6; 8 -1.905,2.6
SOT192P237X117-4N = smd 0.94 x 1.321: 1 -0.864,-1.016 | smd 0.559 x 1.575: 2 1.067,-1.016; 3 1.067,0.889; 4 -1.067,0.889
SOIC127P600X170-8N = smd 1.525 x 0.65: 1 -2.712,1.905; 2 -2.712,0.635; 3 -2.712,-0.635; 4 -2.712,-1.905; 5 2.712,-1.905; 6 2.712,-0.635; 7 2.712,0.635; 8 2.712,1.905
WEMOS_D1_MINI = drill 0.8 octagon: 1 0,0; 2 0,-2.54; 3 0,-5.08; 4 0,-7.62; 5 0,-10.16; 6 0,-12.7; 7 0,-15.24; 8 0,-17.78; 9 22.86,-17.78; 10 22.86,-15.24; 11 22.86,-12.7; 12 22.86,-10.16; 13 22.86,-7.62; 14 22.86,-5.08; 15 22.86,-2.54; 16 22.86,0
SOIC127P600X175-14N = smd 2.057 x 0.61: 1 -4.801,7.62; 2 -4.801,6.35; 3 -4.801,5.08; 4 -4.801,3.81; 5 -4.801,2.54; 6 -4.801,1.27; 7 -4.801,0; 8 0,0; 9 0,1.27; 10 0,2.54; 11 0,3.81; 12 0,5.08; 13 0,6.35; 14 0,7.62
CON_2X18_2MM = drill 0.8 square: 1 0,0 | drill 0.8 octagon: 2 0,-2; 3 0,-4; 4 0,-6; 5 0,-8; 6 0,-10; 7 0,-12; 8 0,-14; 9 0,-16; 10 0,-18; 11 0,-20; 12 0,-22; 13 0,-24; 14 0,-26; 15 0,-28; 16 0,-30; 17 0,-32; 18 0,-34; 19 2,0; 20 2,-2; 21 2,-4; 22 2,-6; 23 2,-8; 24 2,-10; 25 2,-12; 26 2,-14; 27 2,-16; 28 2,-18; 29 2,-20; 30 2,-22; 31 2,-24; 32 2,-26; 33 2,-28; 34 2,-30; 35 2,-32; 36 2,-34
R0603 = smd 1 x 1.1: 1 -0.85,0; 2 0.85,0
R0805 = smd 1.3 x 1.5: 1 -0.95,0; 2 0.95,0
INDC4949X330N = smd 1.85 x 5.1: 1 -2,0; 2 2,0
PIN_254 = drill 1 octagon: 1 0,0
R0402 = smd 0.7 x 0.9: 1 -0.65,0; 2 0.65,0
CTS742C083 = smd 0.5 x 0.9: 1 -1.2,-0.8; 2 -0.4,-0.8; 3 0.4,-0.8; 4 1.2,-0.8; 5 1.2,0.8; 6 0.4,0.8; 7 -0.4,0.8; 8 -1.2,0.8
SOT89 = smd 0.8 x 1.4: 1 -1.499,-1.981; 3 1.499,-1.981 | smd 0.8 x 1.9: 2 0,-1.727 | smd 2.032 x 3.65: 2@1 0,0.94
SOT-23 = smd 0.787 x 0.889: 1 0.025,-1.016; 2 -0.94,1.016; 3 0.991,1.016
ABM3B = smd 1.8 x 1.2: 1 -2,-1.2; 2 2,-1.2; 3 2,1.2; 4 -2,1.2

### Placement (x,y rotation side)
C1  45.7,13.34 180 top
C2  55.48,24.26 270 top
C3  36.51,9.86 0 top
C4  36.51,11.18 0 top
C5  24.5,15.88 270 top
C6  23.23,15.88 270 top
C7  24.5,27.3 90 top
C8  27.14,29.84 180 top
C9  38.46,29.84 0 top
C10  41,27.3 90 top
C11  42.27,27.3 90 top
C12  41.89,23.09 0 top
C13  42.27,15.88 270 top
C14  41,15.88 270 top
C15  38.8,12.95 180 top
C16  35.85,12.45 180 top
C17  31.73,12.7 270 top
C18  27.04,13.34 180 top
C19  36.43,7.49 270 top
C20  44.81,15.24 270 top
C21  44.81,17.78 90 top
C22  27.14,31.12 180 top
C23  23.48,13.59 0 top
C24  41.64,29.59 180 top
C25  42.33,13.67 180 top
C26  24.75,30.48 90 top
C27  15.57,2.19 180 top
C28  13.54,5.59 270 top
C29  38.13,7.42 270 top
C30  31.56,7.14 90 top
C31  61.45,9.53 180 top
C32  61.96,6.99 270 top
C33  43.54,6.99 90 top
C34  18.15,12.07 180 top
C35  8.95,6.25 90 bottom
C36  5.74,6.22 90 bottom
C37  3.29,3.43 180 top
C38  3.53,7.25 90 top
D1  65.14,34.29 90 top
IC1  32.75,21.59 90 top
IC2  50.15,23.11 270 top
IC3  49.26,13.34 90 top
IC4  8.71,5.31 0 top
IC5  58.15,33.02 270 top
IC6  54.34,12.7 270 top
J1  4.91,9.76 180 top
J2  10.4,9.76 180 top
L1  39.99,7.24 90 top
L2  27.04,6.86 270 top
L3  41.64,3.3 270 top
L4  18.11,7.22 0 top
P1  36.56,4.19 0 top
P2  39.1,4.19 0 top
P3  31.48,4.19 0 top
P4  34.02,4.19 0 top
P5  26.4,4.19 0 top
P6  28.94,4.19 0 top
P7  61.96,20.32 270 top
P8  64.5,20.32 270 top
P9  61.96,30.48 270 top
P10  64.5,30.48 270 top
P11  47.99,6.99 0 top
P12  47.99,4.45 0 top
P13  58.15,6.99 0 top
P14  58.15,4.45 0 top
P15  55.61,6.99 0 top
P16  55.61,4.45 0 top
P17  61.96,27.94 270 top
P18  64.5,27.94 270 top
P19  61.96,25.4 270 top
P20  64.5,25.4 270 top
P21  61.96,22.86 270 top
P22  64.5,22.86 270 top
P23  53.07,4.45 0 top
P24  53.07,6.99 0 top
P25  50.53,4.45 0 top
P26  50.53,6.99 0 top
P27  55.61,38.09 0 top
P28  58.18,38.11 0 top
P29  14.23,26.03 0 top
P30  14.27,23.49 0 top
P31  28.31,36.83 0 top
P32  28.31,39.37 0 top
P33  28.31,41.91 0 top
P34  28.31,44.45 0 top
P35  15.61,36.83 0 top
P36  15.61,39.37 0 top
P37  15.61,41.91 0 top
P38  15.61,44.45 0 top
P39  25.77,44.45 0 top
P40  25.77,41.91 0 top
P41  25.77,39.37 0 top
P42  25.77,36.83 0 top
P43  18.15,44.45 0 top
P44  18.15,39.37 0 top
P45  18.15,36.83 0 top
P46  18.15,41.91 0 top
P47  30.85,44.45 0 top
P48  30.85,41.91 0 top
P49  30.85,39.37 0 top
P50  30.85,36.83 0 top
P51  47.99,38.1 0 top
P52  45.45,38.1 0 top
P53  42.91,38.1 0 top
P54  40.37,38.1 0 top
P55  37.83,38.1 0 top
P56  35.29,38.1 0 top
P57  53.07,38.1 0 top
P58  50.53,38.1 0 top
P59  61.96,44.45 0 top
P60  63.23,38.1 0 top
P61  44.18,44.45 0 top
P62  67.04,44.45 0 top
P63  56.88,44.45 0 top
P64  59.42,44.45 0 top
P65  60.69,38.1 0 top
P66  64.5,44.45 0 top
P67  49.26,44.45 0 top
P68  23.23,31.12 0 top
P69  35.29,40.64 0 top
P70  37.83,40.64 0 top
P71  40.37,40.64 0 top
P72  42.91,40.64 0 top
P73  45.45,40.64 0 top
P74  47.99,40.64 0 top
P75  50.53,40.64 0 top
P76  53.07,40.64 0 top
P77  55.61,40.64 0 top
P78  58.15,40.64 0 top
P79  60.69,40.64 0 top
P80  63.23,40.64 0 top
P81  42.91,12.19 180 top
P82  42.91,31.12 270 top
P83  25.38,11.81 0 top
P84  23.86,11.81 0 top
P85  22.34,11.81 0 top
P86  46.72,44.45 0 top
P87  20.69,44.45 0 top
P88  23.23,44.45 0 top
P89  20.69,41.91 0 top
P90  23.23,41.91 0 top
P91  20.69,39.37 0 top
P92  23.23,39.37 0 top
P93  20.69,36.83 0 top
P94  23.23,36.83 0 top
P95  54.34,44.45 0 top
P96  51.8,44.45 0 top
P97  65.77,38.1 0 top
P98  65.77,40.64 0 top
R1  45.07,30.1 90 top
R2  55.74,21.21 0 top
R3  51.9,13.34 270 top
R4  53.07,16.51 270 top
R5  38.44,10.46 270 top
R6  27.04,9.96 90 top
R7  20.81,30.48 90 top
R8  42.15,18.34 180 top
R9  41,44.45 180 top
R11  14.91,20.1 90 top
R12  17.35,20.11 90 top
R14  3.29,1.29 0 top
R16  7.91,1.43 0 top
R18  57.77,23.5 270 top
R19  59.42,23.5 270 top
R20  59.8,29.84 90 top
R21  57.64,29.84 90 top
R26  55.99,29.84 90 top
R27  43.8,26.67 90 bottom
R28  45.45,6.99 90 top
RN1  35.92,33.02 180 top
RN2  29.58,33.66 180 top
RN3  17.51,27.94 180 top
T1  23.91,7.95 180 top
T2  37.2,43.82 180 top
Y1  48.62,17.15 180 top

### Tracks (layer width: path | path; a pad name or v marks a point on that pad's centre or on a via)
3V3D  (via drill 0.41)  (1 unrouted)
  Top 0.203: IC6.4 v58.15,15.11 | v63.23,14.99 63.23,14.61 | R21.2 R20.2 59.8,31.88 60.31,32.38 66.41,32.38 | 25.13,2.54 25.13,4.95 26.02,5.84 26.02,6.69 L2.1 R6.1 | 18.78,0.38 9.8,0.38 R16.2
  Top 0.305: IC6.13 IC6.14 61.96,9.87 C31.1 61.96,9.18 C32.1 62.27,7.62 63.86,7.62 | P23.1 53.07,2.54
  Top 0.406: IC5.9 41.64,8.89 41.64,7.62 42.91,6.35 43.23,6.35 C33.1 44.18,5.4 44.18,2.54
  pour Top (isolate 0.203): 18.65,13.84 18.78,3.68 15.86,3.68 15.86,0 68.31,0 68.31,46.36 66.41,46.36 66.41,39.37 65.14,39.37 65.14,32.38 66.41,32.38 66.41,21.21 63.23,21.21 63.23,2.54 21.83,2.54 21.83,8.13 22.59,8.89 22.46,13.84
3V3MOTU  (1 unrouted)
14V8  (via drill 0.6, 0.61)
  Top 0.203: IC4.8 11.43,7.25 | IC4.1 1.27,7.22
  Top 0.61: v13.32,9.02 v13.32,10.03 | v13.32,9.02 v12.3,9.02 | v13.32,9.02 v13.32,8 v12.3,8 | v11.29,8 11.55,8 IC4.8
  other vias: 1.27,38.1 1.27,36.2 1.27,34.29 1.27,32.38 1.27,30.48 1.27,28.58 1.27,26.67 1.27,24.77 1.27,22.86 1.27,20.95 1.27,19.05 1.27,8.26
  pour Bottom: 0,46.33 11.79,46.33 11.79,40.01 1.91,40.01 1.91,6.35 10.91,6.35 10.91,8.38 11.92,8.38 11.92,9.4 12.94,9.4 12.94,10.41 13.7,10.41 13.7,0 0,0
  pour Top: 0,46.36 11.16,46.36 11.16,39.37 1.91,39.37 1.91,6.99 0,6.99
ADC2
  Top 0.203: IC1.12 33,14.69 33.05,14.63 33.05,5.38 32.12,4.45 P3.1
ADC3
  Top 0.203: IC1.13 33.5,4.97 P4.1
ADC4
  Top 0.203: IC1.14 34,6.12 34.91,5.21 35.8,5.21 P1.1
ADC5
  Top 0.203: IC1.15 34.5,6.38 35.16,5.72 36.94,5.72 38.21,4.45 P2.1
ADC6  (via drill 0.41)  (2 unrouted)
  Top 0.203: IC1.16 35,14.26 v35.29,13.97 | v37.83,31.24 38.72,32.13 39.61,32.13 40.12,31.75 v41.39,31.75
AVDD  (via drill 0.41)  (2 unrouted)
  Top 0.203: v30.21,5.72 30.68,6.19 C30.1 31.95,6.19 32.62,6.86 32.62,12.46 C17.1 31.5,13.58 IC1.9 | L2.2 26.4,4.99 P5.1 | L1.1 40.08,5.97 v40.12,5.46
BCK_ADC  (via drill 0.41)  (3 unrouted)
  Top 0.203: IC1.81 25.36,19.84 v25,20.19 | v32.24,26.06 32.5,26.55 IC1.56
BCK_DAC  (via drill 0.41)  (2 unrouted)
  Top 0.203: IC1.84 23.35,18.34 v23.1,18.09 | R12.1 17.35,19.15 v16.21,18.14
BCK_ESS  (via drill 0.41)  (2 unrouted)
  Top 0.203: IC1.59 31,29.75 v31.35,30.1 | R12.2 17.35,21.5 v18.42,22.48
BCK_EXT  (via drill 0.41)  (1 unrouted)
  Top 0.203: v34.4,25.91 35,26.58 IC1.51 35,29.3 35.54,29.84 35.54,30.61 34.78,31.37 34.78,32.16 RN1.5 | IC1.76 23.09,22.34 v22.72,21.97
BCK_IN0
  Top 0.203: IC1.73 16.42,23.84 P29.1
BCK_OUT0
  Top 0.203: IC1.48 36.5,31.18 36.31,31.37 36.31,32.2 RN1.7
CLKOUT
  Top 0.203: 38.34,18.34 38.72,18.34 | 38.72,18.34 40.12,18.34 | IC1.27 38.72,18.34
D1_RST
  Top 0.203: R26.2 57.93,33.02 IC5.1
DAT_ADC12  (2 unrouted)
DAT_ADC34  (2 unrouted)
DAT_ADC56  (2 unrouted)
DAT_ADC78  (2 unrouted)
DAT_DAC12  (via drill 0.41)  (1 unrouted)
  Top 0.203: IC1.75 22.44,22.84 21.32,21.72 21.32,20.95 17.64,17.27 v17.08,17.27
DAT_DAC34  (via drill 0.41)  (1 unrouted)
  Top 0.203: IC1.78 24.88,21.34 24.11,20.57 22.21,20.57 17.39,15.76 v12.13,15.76
DAT_DAC56  (via drill 0.41)  (1 unrouted)
  Top 0.203: IC1.83 21.75,18.84 17.91,15.01 v13.63,15.01
DAT_DAC78  (via drill 0.41)  (1 unrouted)
  Top 0.203: IC1.86 21.52,17.34 18.53,14.35 15.35,14.35 13.75,12.76 v12.63,12.76
DAT_ESS12  (via drill 0.41)  (2 unrouted)
  Top 0.203: IC1.49 36,26.85 v36.69,25.91
  other vias: 13.13,16.76
DAT_ESS34  (via drill 0.41)  (1 unrouted)
  Top 0.203: IC1.52 34.5,29.94 v34.78,30.23
DAT_ESS56  (via drill 0.41)  (1 unrouted)
  Top 0.203: IC1.57 32,28.59 v32.75,29.34
DAT_ESS78  (via drill 0.41)  (1 unrouted)
  Top 0.203: IC1.60 30.5,30.64 31.1,31.24 v31.48,31.24
DAT_EXT12
  Top 0.203: RN2.4 28.38,36.76 P31.1
DAT_EXT34
  Top 0.203: RN2.3 29.18,35.41 29.37,35.69 29.37,38.23 29.32,38.35 P32.1
DAT_EXT56
  Top 0.203: RN2.2 29.98,35.54 29.78,35.69 29.78,39.75 29.72,40.49 P33.1
DAT_EXT78
  Top 0.203: RN2.1 30.78,34.86 32.12,36.2 32.12,42.55 31.48,43.18 29.58,43.18 P34.1
DAT_IO12
  Top 0.203: IC1.72 18.44,24.34 16.24,26.54 16.24,27.07 RN3.5
DSPRST  (via drill 0.41)  (1 unrouted)
  Top 0.203: IC1.28 39.52,18.84 39.99,19.3 51.8,19.3 v52.31,19.05 52.05,18.8 52.05,13.83 R3.1 50.49,14.19 IC3.2 | R26.1 55.82,29.21 v55.23,28.83
DVDD  (via drill 0.6, 0.61)  (3 unrouted)
  Top 0.203: 43.16,13.93 43.16,15.88 42.51,16.52 C13.1 C14.1 | C5.1 C6.1 23.21,16.51 22.72,16.51 22.34,16.13 22.34,14.61 22.91,14.03 C23.1
  Top 0.254: IC1.24 40.69,16.84 C14.1 | IC1.43 40.69,26.34 C10.1 | IC1.87 24.81,16.84 C5.1
  Top 0.305: IC1.65 28,29.53 C8.1 C22.1 27.69,31.73 27.29,32.13 25.51,32.13 24.81,31.43 C26.2 24.43,31.75 23.86,31.75 P68.1 | C10.1 C11.1 42.77,26.66 43.29,27.18 43.29,28.76 C24.1 42.91,29.91 P82.1 | 43.16,13.93 C25.1 42.89,12.08 P81.1
  Top 0.406: T1.2 23.91,11.76 P84.1 | P84.1 P83.1 25.26,11.81 23.86,10.41 22.46,11.81 P85.1 | C23.1 22.53,13.14 | 22.53,13.14 P84.1 | 22.53,13.14 22.53,12
  Top 1.016: v22.59,7.62 22.59,3.3 24.24,3.3 24.24,5.08 v23.86,5.08 | v23.86,5.08 v25.13,6.35 v25.13,7.62 25,7.62 23.86,8.76 22.72,7.62 | v23.86,5.08 23.35,5.08 23.35,4.06
  other vias: 22.59,6.35 22.59,5.08 23.86,8.89 22.59,3.81 23.86,3.81
  pour Bottom (isolate 0.203): 14.33,10.16 18.78,10.16 20.69,12.07 37.83,12.07 37.83,8.26 41,5.08 41,0 14.33,0
  pour Route15: 18.78,13.34 26.78,13.34 26.78,6.73 25.13,5.08 25.13,1.91 14.97,1.91 14.97,9.53
EXT12  (1 unrouted)
EXT34  (1 unrouted)
EXT56  (1 unrouted)
EXT78  (1 unrouted)
GND  (via drill 0.41, 0.61)  (1 unrouted)
  Top 0.203: 27.49,16.36 26.53,16.36 26.53,16.34 IC1.88 | 27.49,16.36 27.49,15.88 | 38.64,26.82 38.01,26.82 38.01,27.56 38,27.56 IC1.45 | 27.49,27.51 27.49,26.82 26.5,26.82 IC1.67 | 24.67,29.23 24.67,28.07 | C26.1 26.45,29.54 | 40.37,29.72 39.11,29.72 C9.2 | 41,28.07 40.88,28.07 40.88,29.59 | 11.16,3.18 11.43,3.18 IC4.5 | 29.58,18.41 v29.7,18.54 28.94,17.78 28.92,17.78 27.49,16.36
  Bottom 0.203: R27.1 43.76,25.78 42.78,25.78
  other vias: 35.92,24.64 35.92,23.5 35.92,22.1 35.92,20.83 35.92,19.56 35.92,18.54 34.78,24.64 33.51,24.64 32.24,24.64 30.85,24.64 29.7,24.64 29.7,23.37 29.7,22.1 29.7,20.83 29.7,19.56 30.97,18.54 32.24,18.54 33.51,18.54 34.78,18.54 48.62,18.41 48.62,15.88 43.8,23.11 49.39,21.08 55.74,22.35 33.13,23.62 34.78,21.21 32.37,19.56 30.85,21.97 31.99,21.97 33.13,22.48 33.51,21.21 32.37,20.7
  pour Top (isolate 0.203): 11.62,46.36 65.9,46.36 65.9,40.01 63.86,40.01 63.86,32.38 65.9,32.38 65.9,21.84 62.72,21.84 62.72,3.05 25.77,3.05 25.77,12.07 23.48,12.07 23.48,14.35 17.51,14.35 17.51,10.8 17.13,10.8 13.19,10.8 13.22,8.26 11.01,8.26 10.73,8.26 10.53,8.26 10.53,3.56 15.35,3.56 15.35,-0.18 -0.04,-0.18 0,6.35 2.54,6.35 2.54,38.73 11.62,38.73
  pour Bottom: 12.43,46.36 68.31,46.36 68.31,0 42.27,0 42.27,5.08 39.1,8.26 39.1,12.7 20.05,12.7 18.15,10.8 12.43,10.8 12.43,9.65 10.4,9.65 10.4,6.99 2.54,6.99 2.54,39.37 12.43,39.37
GPIO0  (via drill 0.41)  (2 unrouted)
  Top 0.203: IC5.12 47.99,9.4 46.47,7.87 46.47,4.19 v46.21,3.94
GPIO2  (1 unrouted)
IN_ADC12  (2 unrouted)
IN_ADC34  (2 unrouted)
IN_ADC56  (2 unrouted)
IN_ADC78  (2 unrouted)
IOVDD  (via drill 0.41, 0.61, 0.8)  (7 unrouted)
  Top 0.203: IC2.7 IC2.8 52.84,25.11 C2.1 56.5,25.11 | IC1.22 38,14.91 C15.1 39.61,13.34 | C9.1 37.81,29.96 38.97,31.12 v39.35,31.12 | R19.1 R18.1 57.01,25.11 56.5,25.11 | 28,13.65 C18.1 | R2.2 56.5,21.5 56.5,25.11 | C12.1 41.22,23.11 v40.5,23.11 | R1.2 45.66,30.35 v46.34,30.35
  Top 0.254: IC1.2 28,13.65 | IC1.46 37.5,29.53 C9.1 | IC1.68 24.81,26.34 C7.1 23.88,26.66 v23.23,27.3 | IC1.37 40.27,23.34 v40.5,23.11
  Top 0.305: IC3.4 47.56,12.27 v47.35,12.7 46.72,13.04 C1.1 | IC2.8 52.49,24.77 v50.53,24.77 | C18.1 27.67,13.32 v27.67,12.45 | 39.61,13.34 39.61,13.97 v39.23,14.73
  Top 0.61: v42.91,4.19 41.7,4.19 L3.1 v41.64,5.33
  Bottom 0.61: 39.1,11.94 39.1,8.89 42.91,5.08 v42.91,4.19 | 39.1,11.94 39.1,13.97 v39.23,14.73 | v39.86,11.68 39.1,11.94
LRK_ADC  (via drill 0.41)  (3 unrouted)
  Top 0.203: IC1.82 23.57,19.34 v23.1,19.69 | v33.26,25.91 33,26.52 IC1.55
LRK_DAC  (via drill 0.41)  (2 unrouted)
  Top 0.203: IC1.85 27.86,17.84 v28.18,18.16 | R11.1 13.01,19.15 v12.27,19.89
LRK_ESS  (via drill 0.41)  (2 unrouted)
  Top 0.203: IC1.58 31.5,29.1 32.37,29.97 32.37,30.23 v32.62,30.48 | R11.2 15.06,21.05 15.06,21.68 15.63,22.26 16.77,22.26 v17.11,22.6
LRK_EXT  (via drill 0.41)  (1 unrouted)
  Top 0.203: v35.54,25.91 35.5,26.84 IC1.50 35.5,28.91 36.03,29.44 36.03,30.89 35.54,31.37 35.54,32.2 RN1.6 | IC1.77 24.24,21.84 v23.73,21.34
LRK_IN0_MP10  (via drill 0.41)  (1 unrouted)
  Top 0.203: IC1.74 15.06,23.34 P30.1 | R7.1 20.81,28.7 v20.69,28.45
LRK_OUT0_MP4
  Top 0.203: IC1.47 37,32.09 RN1.8
M0_ADC  (1 unrouted)
M1_ADC  (1 unrouted)
MCK_ADC  (1 unrouted)
MISO  (via drill 0.41)  (2 unrouted)
  Top 0.203: IC1.38 39.75,23.84 39.8,23.89 43.91,23.89 46.09,26.04 v49.89,26.04 59.55,26.04 v59.67,25.78
MISO_M
  Top 0.203: IC1.35 38.76,22.35 39.68,22.35 39.73,22.3 44.13,22.3 44.18,22.35 45.58,23.75 IC2.2
MOSI  (via drill 0.41)  (1 unrouted)
  Top 0.203: IC1.40 43.62,24.84 47.48,28.7 v49.01,28.7 51.8,28.7 52.56,27.94 60.05,27.94 61.32,26.67 63.23,26.67 P20.1
MOSI_M
  Top 0.203: IC1.33 44.69,21.34 45.2,21.84 49.89,21.84 50.53,21.21 IC2.5
MP14  (via drill 0.41)  (1 unrouted)
  Top 0.203: IC1.6 30,9.32 v28.69,8
MP15  (via drill 0.41)  (1 unrouted)
  Top 0.203: IC1.7 30.5,8.67 v28.69,6.86
MP24  (via drill 0.41)  (1 unrouted)
  Top 0.203: IC1.30 57.8,19.84 v59.17,21.21 59.42,21.46 R19.2
MP25  (via drill 0.41)  (1 unrouted)
  Top 0.203: IC1.31 57.37,20.34 57.98,20.95 v58.02,21.21 58.02,22.35 57.9,22.48 R18.2
N$1
  Top 0.203: T2.1 37.55,44.45 R9.2
N$2
  Top 0.203: IC1.64 28.5,32.06 28.43,32.13 28.43,32.8 RN2.5
N$3
  Top 0.203: IC1.63 29,32.07 29.18,32.25 RN2.6
N$4
  Top 0.203: IC2.3 50.02,22.48 50.66,21.84 54.34,21.84 54.58,21.7 R2.1
N$5
  Top 0.203: IC1.62 29.5,31.55 29.98,32.02 RN2.7
N$6
  Top 0.203: IC1.61 30,31.29 30.78,32.06 RN2.8
N$7
  Top 0.203: IC1.70 19.22,25.34 17.91,26.65 RN3.7
N$8
  Top 0.203: IC1.71 18.83,24.84 17.11,26.56 RN3.6
N$10
  Top 0.203: Y1.1 50.46,18.34 49.26,17.15 44.83,17.15 | 44.83,17.15 C21.1 | 44.83,17.15 44.31,17.15 43.16,18.29 42.85,18.29 R8.1
N$11
  Top 0.203: RN3.1 18.71,32.45 15.61,35.56 P35.1
N$12
  Top 0.203: R5.2 37.2,9.82 C3.2
N$13
  Top 0.203: IC1.69 19.61,25.84 18.78,26.67 18.78,27.07 RN3.8
N$14
  Top 0.203: R9.1 43.12,43.18 65.14,43.18 66.91,41.4 66.91,39.88 66.41,39.37 65.14,39.37 64.5,38.73 64.5,34.93 64.09,34.51 D1.C
N$15
  Top 0.203: RN3.2 17.91,31.48 14.08,35.31 14.08,37.85 P36.1
N$18
  Top 0.203: RN3.4 16.31,29.14 12.18,33.27 12.18,41.02 P38.1
N$19
  Top 0.203: 14.46,4.7 14.84,4.7 14.84,4.19
  Top 1.016: 13.54,4.68 C28.2 | 14.46,4.71 14.46,4.7
  Top 1.27: IC4.6 13.54,4.68 | C28.2 14.46,4.71
  pour Top (isolate 0.025): 14.72,4.19 14.72,10.29 17.51,10.29 17.51,4.19
N$20
  Top 0.203: IC4.7 12.95,5.95 C28.1
N$21
  Top 0.025: 0,1.27 0,0 0.27,0
N$22
  Top 0.203: C37.1 6,3.43 IC4.4
N$23
  Top 0.203: RN3.3 17.11,30.24 13.19,34.16 13.19,39.5 P37.1
N$24
  Top 0.025: 1.27,46.36 0,46.36 0,45.09
N$25
  Top 0.025: 67.04,46.36 68.31,46.36 68.31,45.09
N$26
  Top 0.025: 68.31,1.27 68.31,0 67.04,0
N$27
  Bottom 0.025: 0,45.09 0,46.36 1.27,46.36
N$28
  Route2 0.025: 0,45.09 0,46.36 1.27,46.36
N$29
  Route15 0.025: 0,45.09 0,46.36 1.27,46.36
N$30  (2 unrouted)
  Route2 0.025: 68.31,45.09 68.31,46.36 67.04,46.36
  Route15 0.025: 67.04,46.36 68.31,46.36 68.31,45.09
  Bottom 0.025: 68.31,45.09 68.31,46.36 67.04,46.36
N$31  (2 unrouted)
  Route2 0.025: 67.04,0 68.31,0 68.31,1.27
  Route15 0.025: 68.31,1.27 68.31,0 67.04,0
  Bottom 0.025: 67.04,0 68.31,0 68.31,1.27
N$32
  Top 0.203: IC4.3 3.53,4.68 C38.1
N$33
  Top 0.203: 7.06,1.27 7.06,1.29 | R14.2 7.06,1.29 | 7.06,1.29 R16.1 7.15,1.42 7.15,1.84 7.18,2.78 7.18,5.88 7.12,5.95 IC4.2
N$34  (2 unrouted)
  Route2 0.025: 1.27,0 0,0 0,1.27
  Route15 0.025: 0,1.27 0,0 1.27,0
  Bottom 0.025: 1.27,0 0,0 0,1.27
N$51  (1 unrouted)
N$54  (1 unrouted)
N$55  (1 unrouted)
N$56  (1 unrouted)
N$57  (1 unrouted)
N$58  (1 unrouted)
PBCKEXT
  Top 0.203: RN1.4 34.73,36.27 35.29,36.83 P56.1
PBCKOUT0
  Top 0.203: RN1.2 36.32,34.56 36.56,34.8 52.31,34.8 54.34,36.83 54.34,38.73 54.98,39.37 56.92,39.37 P28.1
PLLFILT
  Top 0.203: IC1.20 37,13.28 37.32,12.95 37.32,11.34 C4.2 37.22,11.12 R5.1
PLRKEXT
  Top 0.203: RN1.3 35.52,35.16 37.83,37.47 P55.1
PLRKOUT0
  Top 0.203: RN1.1 37.59,34.29 53.07,34.29 55.61,36.83 P27.1
PMP6  (via drill 0.41)  (1 unrouted)
  Top 0.203: IC1.53 34,34.91 v33.89,34.93 | P57.1 53.07,36.83 51.8,35.56 v39.1,35.56
PMP7  (via drill 0.41)  (1 unrouted)
  Top 0.203: IC1.54 33.5,34.18 33,34.67 33,35.18 v33.89,36.07 | P58.1 50.53,36.83 50.02,36.32 38.08,36.32 v37.83,36.07
PMP10  (via drill 0.41)  (3 unrouted)
  Top 0.203: T2.3 35.19,43.82 v34.02,43.82 32.75,42.55 32.75,36.2 31.48,34.93 31.48,34.29 v32.12,33.66 | IC5.3 51.8,31.75 49.26,31.75 v47.99,30.48 | R7.2 20.81,31.88 v21.96,33.02
PVDD
  Top 0.203: IC1.19 36.5,12.5 C16.1 36.45,11.77 C4.1 C3.1 35.86,8.92 C19.1 38.1,8.4 C29.1 38.36,8.09 L1.2
RST_ADC  (1 unrouted)
RST_ESS  (1 unrouted)
RST_VOL  (via drill 0.41)  (2 unrouted)
  Top 0.203: R28.1 v45.45,5.08
SBOOT  (via drill 0.41)
  Top 0.203: IC1.42 43.35,25.84 44.69,27.18 v44.69,28.32 45.07,28.7 R1.1
  Bottom 0.203: v44.69,28.32 44.56,28.28 R27.2
SCL  (via drill 0.41)  (3 unrouted)
  Top 0.203: P25.1 51.8,5.72 51.8,8.89 IC5.14 | P9.1 61.96,29.84 61.11,28.99 R20.1 v60.56,28.83
SCL_BRD  (1 unrouted)
SCLK  (via drill 0.41)  (1 unrouted)
  Top 0.203: IC1.39 43.75,24.34 47.35,27.94 v51.16,27.94 51.8,27.3 60.05,27.3 P19.1
SCLK_M
  Top 0.203: IC1.34 38.75,21.84 44.43,21.84 45.7,23.11 50.02,23.11 50.66,22.48 IC2.6
SDA  (via drill 0.41)  (4 unrouted)
  Top 0.203: IC5.13 P26.1 | v58.4,28.83 R21.1
SDA_BRD  (1 unrouted)
SPDIF_I+
  Top 0.203: IC6.12 59.42,11.05 59.67,10.8 59.67,5.97 P14.1
SPDIF_I-
  Top 0.203: IC6.11 58.15,11.56 59.17,10.54 59.17,8 P13.1
SPDIF_O+
  Top 0.203: IC6.9 55.61,11.56 54.47,10.41 54.47,5.33 P16.1
SPDIF_O-
  Top 0.203: IC6.10 56.88,8.26 P15.1
SPDIFIN  (via drill 0.41)  (1 unrouted)
  Top 0.203: IC1.4 29,10.6 v28.69,10.29 | v60.69,15.75 IC6.2
SPDIFOUT  (via drill 0.41)  (1 unrouted)
  Top 0.203: IC1.5 29.5,10.09 v28.69,9.14 | v56.88,15.11 IC6.5
SS  (via drill 0.41)  (1 unrouted)
  Top 0.203: IC1.41 43.48,25.34 47.23,29.08 v47.23,29.59 47.23,31.24 46.59,31.88 44.05,31.88 IC5.7 | v48.37,26.92 50.78,26.92 51.04,26.67 60.05,26.67 60.82,25.91 60.82,24.64 61.96,23.5 P21.1
SS_M  (via drill 0.41)
  Top 0.203: IC1.32 45.34,20.84 v45.58,21.06 | v45.83,24.64 46.28,25.02 IC2.1
  Bottom 0.203: v45.58,21.06 45.83,21.31 v45.83,24.64
USBRST  (via drill 0.41)  (1 unrouted)
  Top 0.203: R4.1 53.07,18.41 53.96,19.3 58.4,19.3 60.69,21.59 v60.69,23.62
USBRST_
  Top 0.203: R4.2 53.07,13.34 49.31,13.34 IC3.3 46.14,14.4 45.7,13.97 45.7,11.81 46.72,10.8 46.72,9.11 R28.2
VDRIVE
  Top 0.203: IC1.3 28.5,12.07 R6.2 27.1,10.92 26.11,9.93 T1.1 25.66,10.06
XTALIN
  Top 0.203: IC1.25 42.84,17.34 44.31,15.88 44.8,15.88 C20.1 44.87,15.95 Y1.3
XTALOUT
  Top 0.203: IC1.26 41,17.84 R8.2
(copper drawn outside any net)
  shapes: Top area x4

### Text on the board
tPlace: J10 | J11 | J9 | 78 | J1 | 56 | 34 | 12 | G | J2 | A | B | C | D | E | F | J3 | k | J4 | J8 | usbi | SigmaDSP | 2 connectors mounted on solder side! | J5 | analog | J7 | J6 | spdif | DSP_MOTU / V1 03-2019
bPlace: DSP_MOTU V1.0 03-2019